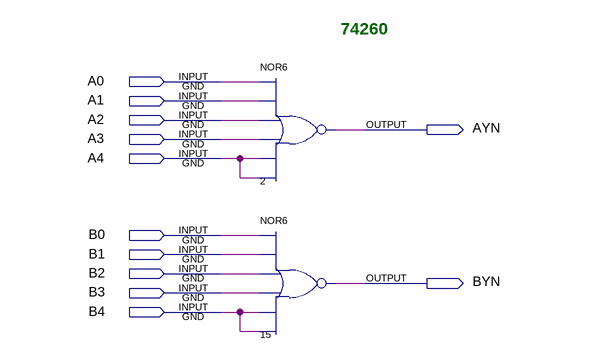
[diagram p0: schematic sheet]
// Quartus schematic 74260.bdf as structural Verilog: 2 symbols, 12 pins
module \74260  (
  input  A0,
  input  A1,
  input  A2,
  input  A3,
  input  A4,
  input  B0,
  input  B1,
  input  B2,
  input  B3,
  input  B4,
  output AYN,
  output BYN
);

  nor u_2 (AYN, A0, A1, A2, A3, A4, A4);
  nor u_15 (BYN, B0, B1, B2, B3, B4, B4);

  // Notes on the sheet:
  //   74260
endmodule
